# EAGLE schematic Relaya module GHII (EAGLE 9.1.2)
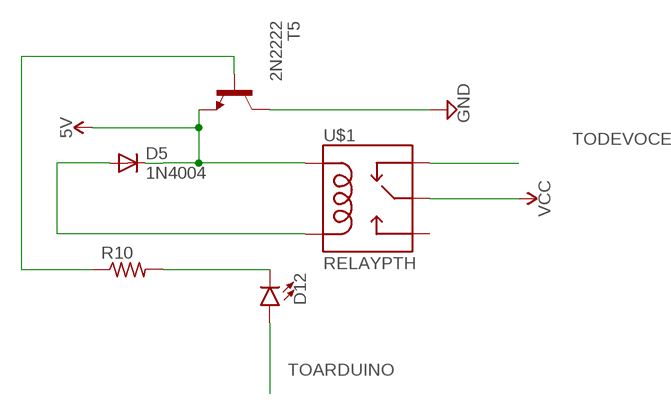
[diagram p0: schematic, sheet 1]

## Parts
D5  1N4004  [DO41-10]
D12  LED5MM  [LED_5MM]
R10  R-US_0207/10  [0207/10]
T5  2N2222  [TO92-EBC-OVAL]
U$1  RELAYPTH  [SRD-05VDC-SL-C]

## Nets
GND [Power]: T5.C
N$2: D12.K(C) R10.2
N$5: R10.1 T5.B
N$16 [Data]: D5.A U$1.COIL0
TOARDUINO: D12.A
TODEVOCE [Data]: U$1.SWCLOSED(SWCLOSE)
VCC: U$1.SWCOMMON
VCCIO: D5.C T5.E U$1.COIL1 ; supply symbol labelled 5V
Unconnected: U$1.SWOPEN

## Library data of the parts
D5 = adafruit:1N4004: DIODE General purpose 1N400x type rectifier (With bigger pads) http://www.ladyada.net/library/pcb/eaglelibrary.html
D12 = SparkFun-LED:LED: LED (Generic) Standard schematic elements and footprints for 5mm, 3mm, 1206, and 0603 sized LEDs. Generic LEDs with no color specified.
R10 = adafruit:R-US_: RESISTOR, American symbol
T5 = adafruit:2N2222: NPN TRANSISTOR Big oval pads
U$1 = SRD-Relay:RELAY: SPDT relay (COM-00101)

## Net classes
1 Power: width 0.762 mm, drill 0.762 mm, clearance 0.635 mm
2 Data: width 0.762 mm, drill 0.762 mm, clearance 0.635 mm